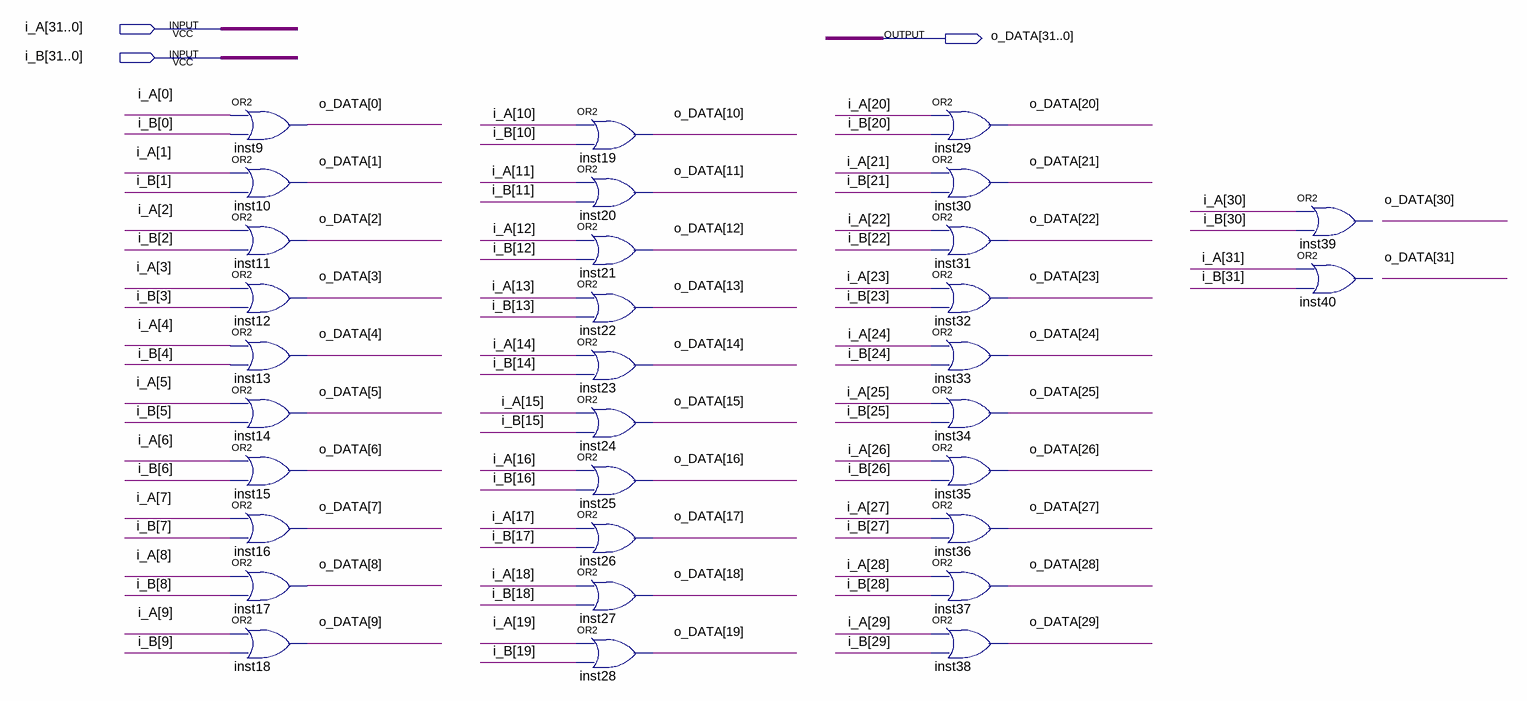
[diagram p0: schematic sheet]
// Quartus schematic or32.bdf as structural Verilog: 32 symbols, 3 pins
module or32 (
  input  [31:0] i_A,
  input  [31:0] i_B,
  output [31:0] o_DATA
);

  or inst9 (o_DATA[0], i_A[0], i_B[0]);
  or inst10 (o_DATA[1], i_A[1], i_B[1]);
  or inst11 (o_DATA[2], i_A[2], i_B[2]);
  or inst12 (o_DATA[3], i_A[3], i_B[3]);
  or inst13 (o_DATA[4], i_A[4], i_B[4]);
  or inst14 (o_DATA[5], i_A[5], i_B[5]);
  or inst15 (o_DATA[6], i_A[6], i_B[6]);
  or inst16 (o_DATA[7], i_A[7], i_B[7]);
  or inst17 (o_DATA[8], i_A[8], i_B[8]);
  or inst18 (o_DATA[9], i_A[9], i_B[9]);
  or inst19 (o_DATA[10], i_A[10], i_B[10]);
  or inst20 (o_DATA[11], i_A[11], i_B[11]);
  or inst21 (o_DATA[12], i_A[12], i_B[12]);
  or inst22 (o_DATA[13], i_A[13], i_B[13]);
  or inst23 (o_DATA[14], i_A[14], i_B[14]);
  or inst24 (o_DATA[15], i_A[15], i_B[15]);
  or inst25 (o_DATA[16], i_A[16], i_B[16]);
  or inst26 (o_DATA[17], i_A[17], i_B[17]);
  or inst27 (o_DATA[18], i_A[18], i_B[18]);
  or inst28 (o_DATA[19], i_A[19], i_B[19]);
  or inst29 (o_DATA[20], i_A[20], i_B[20]);
  or inst30 (o_DATA[21], i_A[21], i_B[21]);
  or inst31 (o_DATA[22], i_A[22], i_B[22]);
  or inst32 (o_DATA[23], i_A[23], i_B[23]);
  or inst33 (o_DATA[24], i_A[24], i_B[24]);
  or inst34 (o_DATA[25], i_A[25], i_B[25]);
  or inst35 (o_DATA[26], i_A[26], i_B[26]);
  or inst36 (o_DATA[27], i_A[27], i_B[27]);
  or inst37 (o_DATA[28], i_A[28], i_B[28]);
  or inst38 (o_DATA[29], i_A[29], i_B[29]);
  // OR2 inst39 has open pins: IN1=i_A[30], IN2=i_B[30], OUT=open
  // OR2 inst40 has open pins: IN1=i_A[31], IN2=i_B[31], OUT=open
endmodule
